# EAGLE schematic LED_PI_0.1 (EAGLE 5.06)
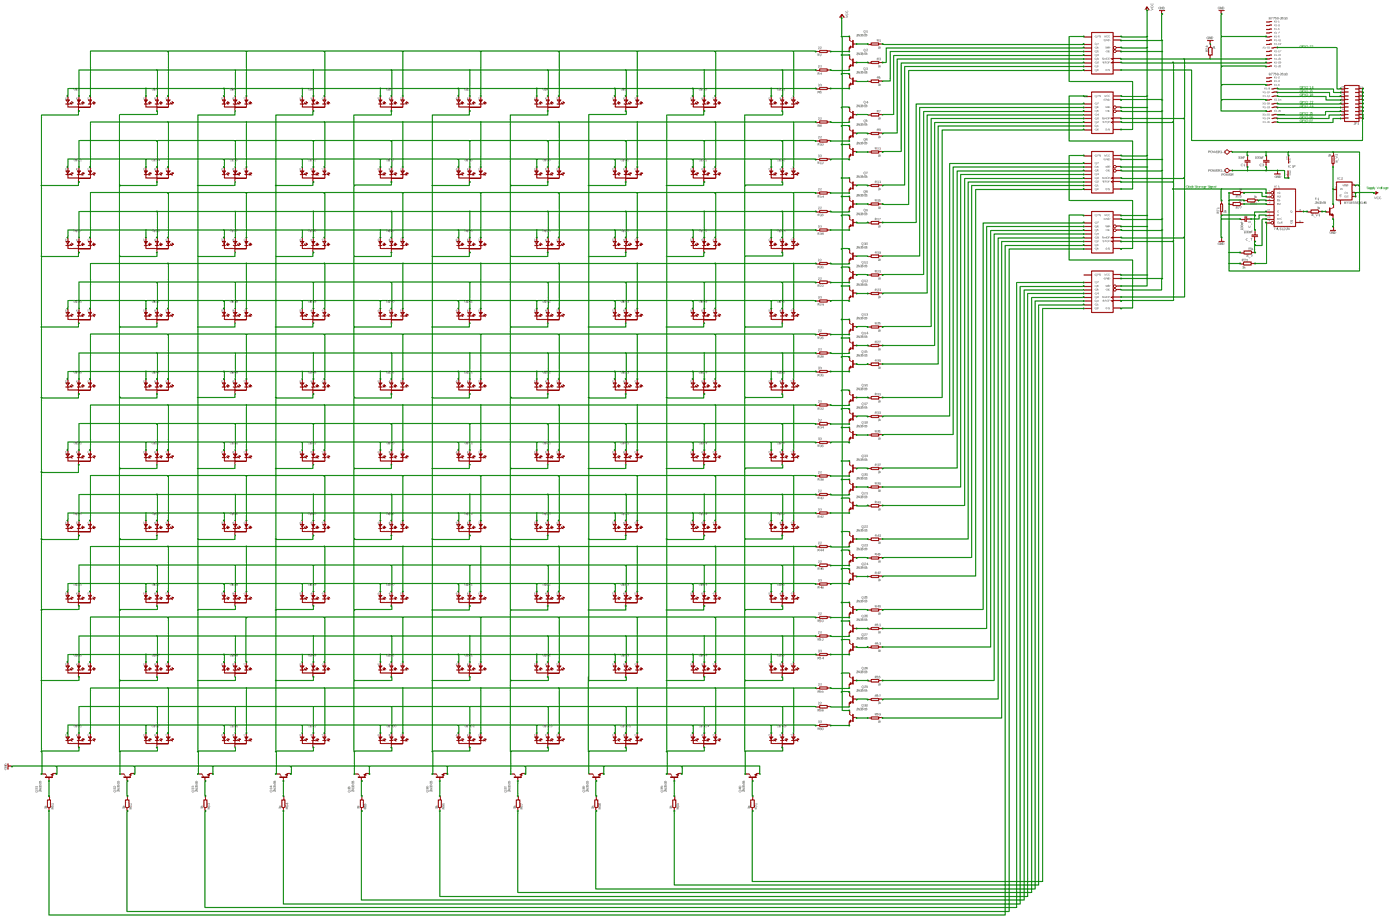
[diagram p0: schematic, sheet 1, overview]
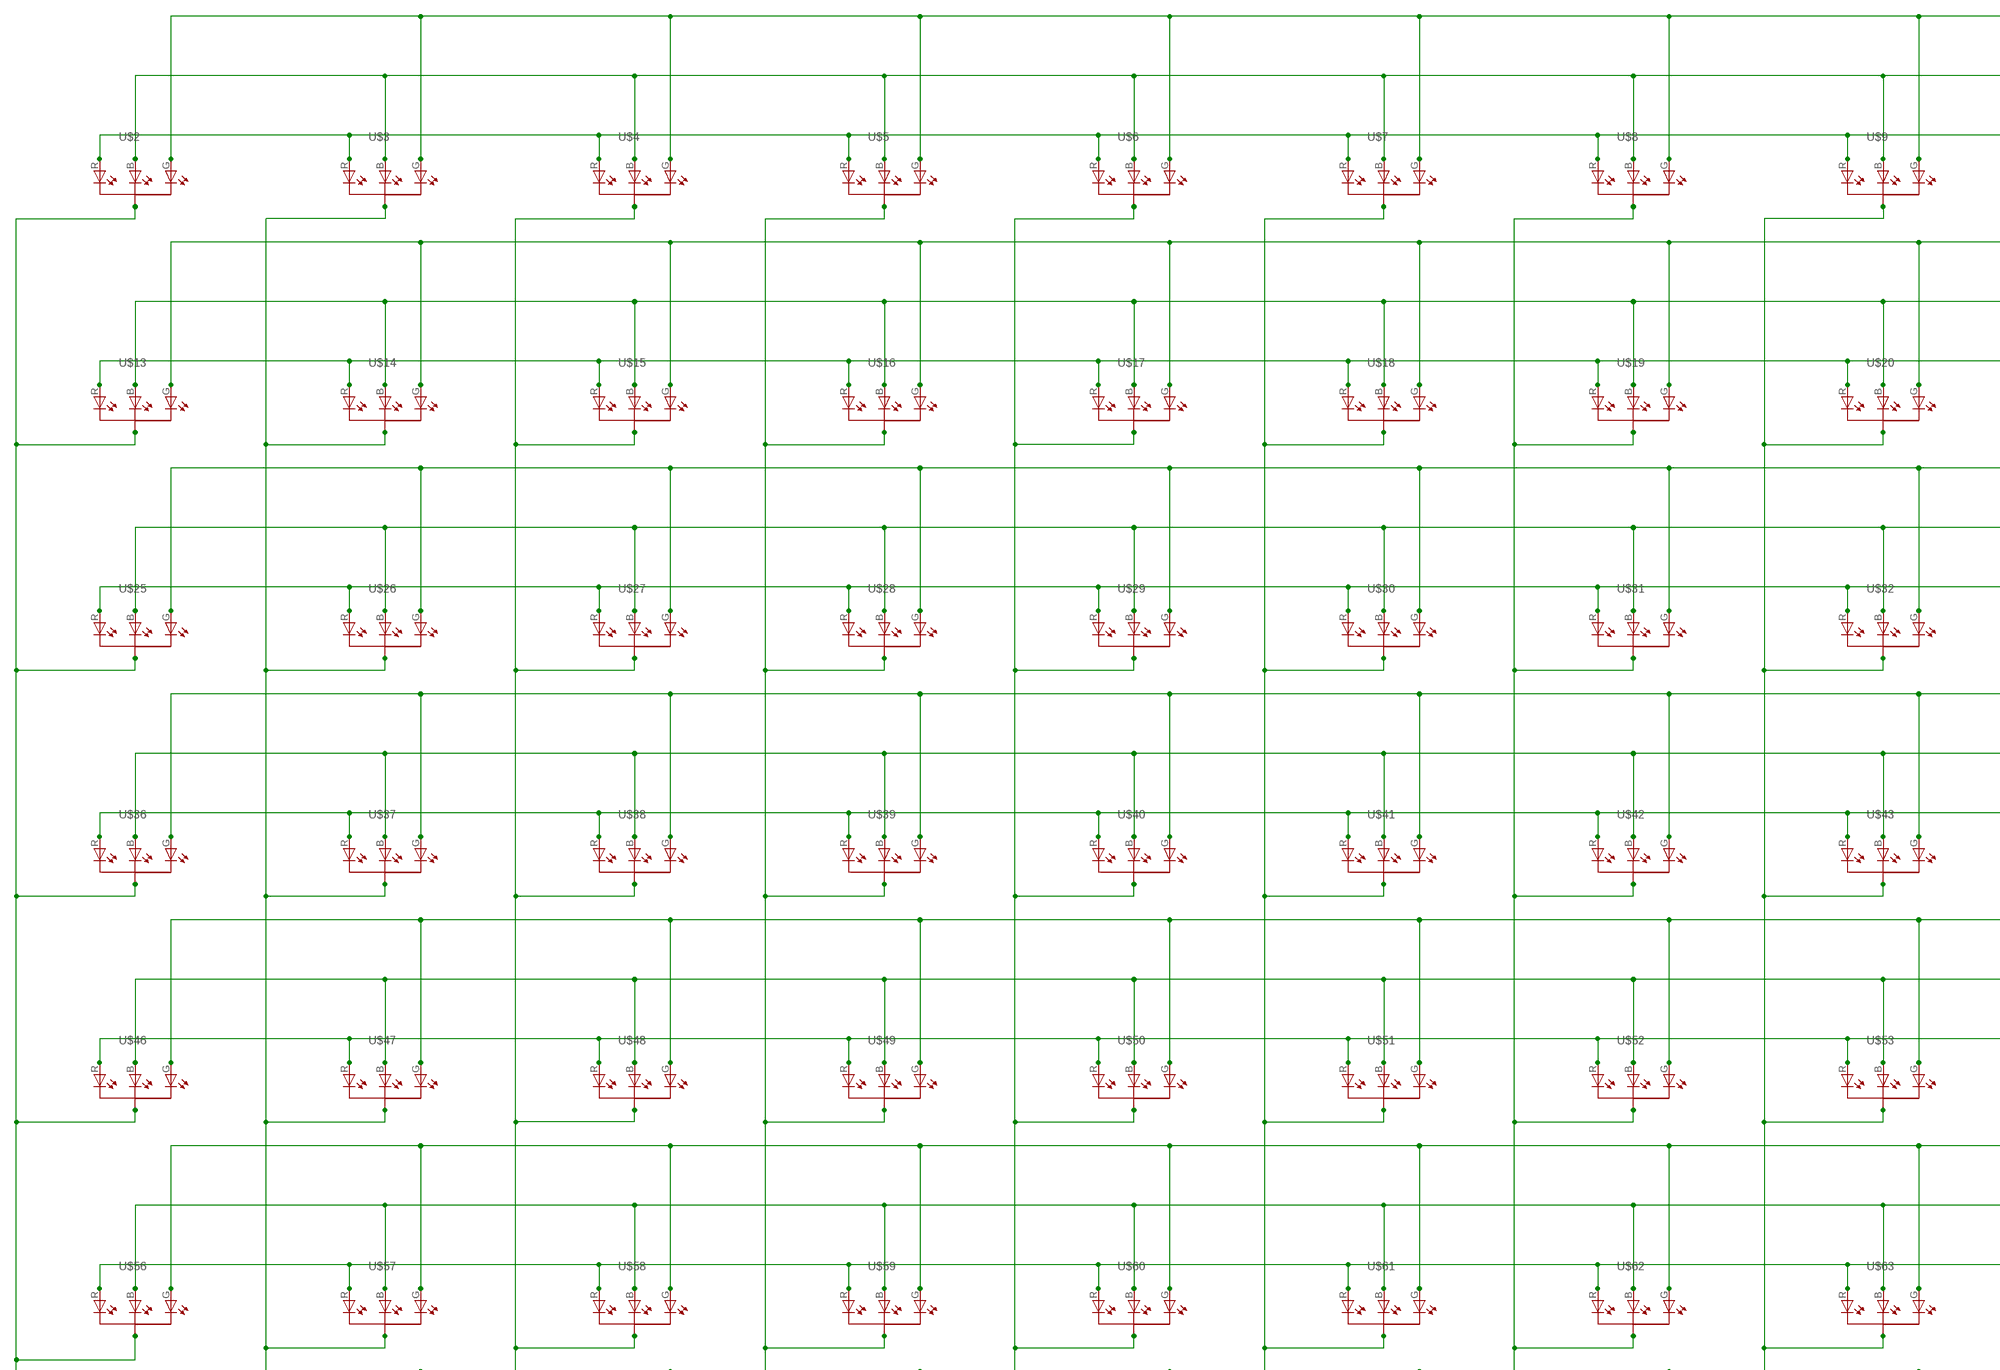
[diagram p1: schematic, sheet 1, part 1 of 5]
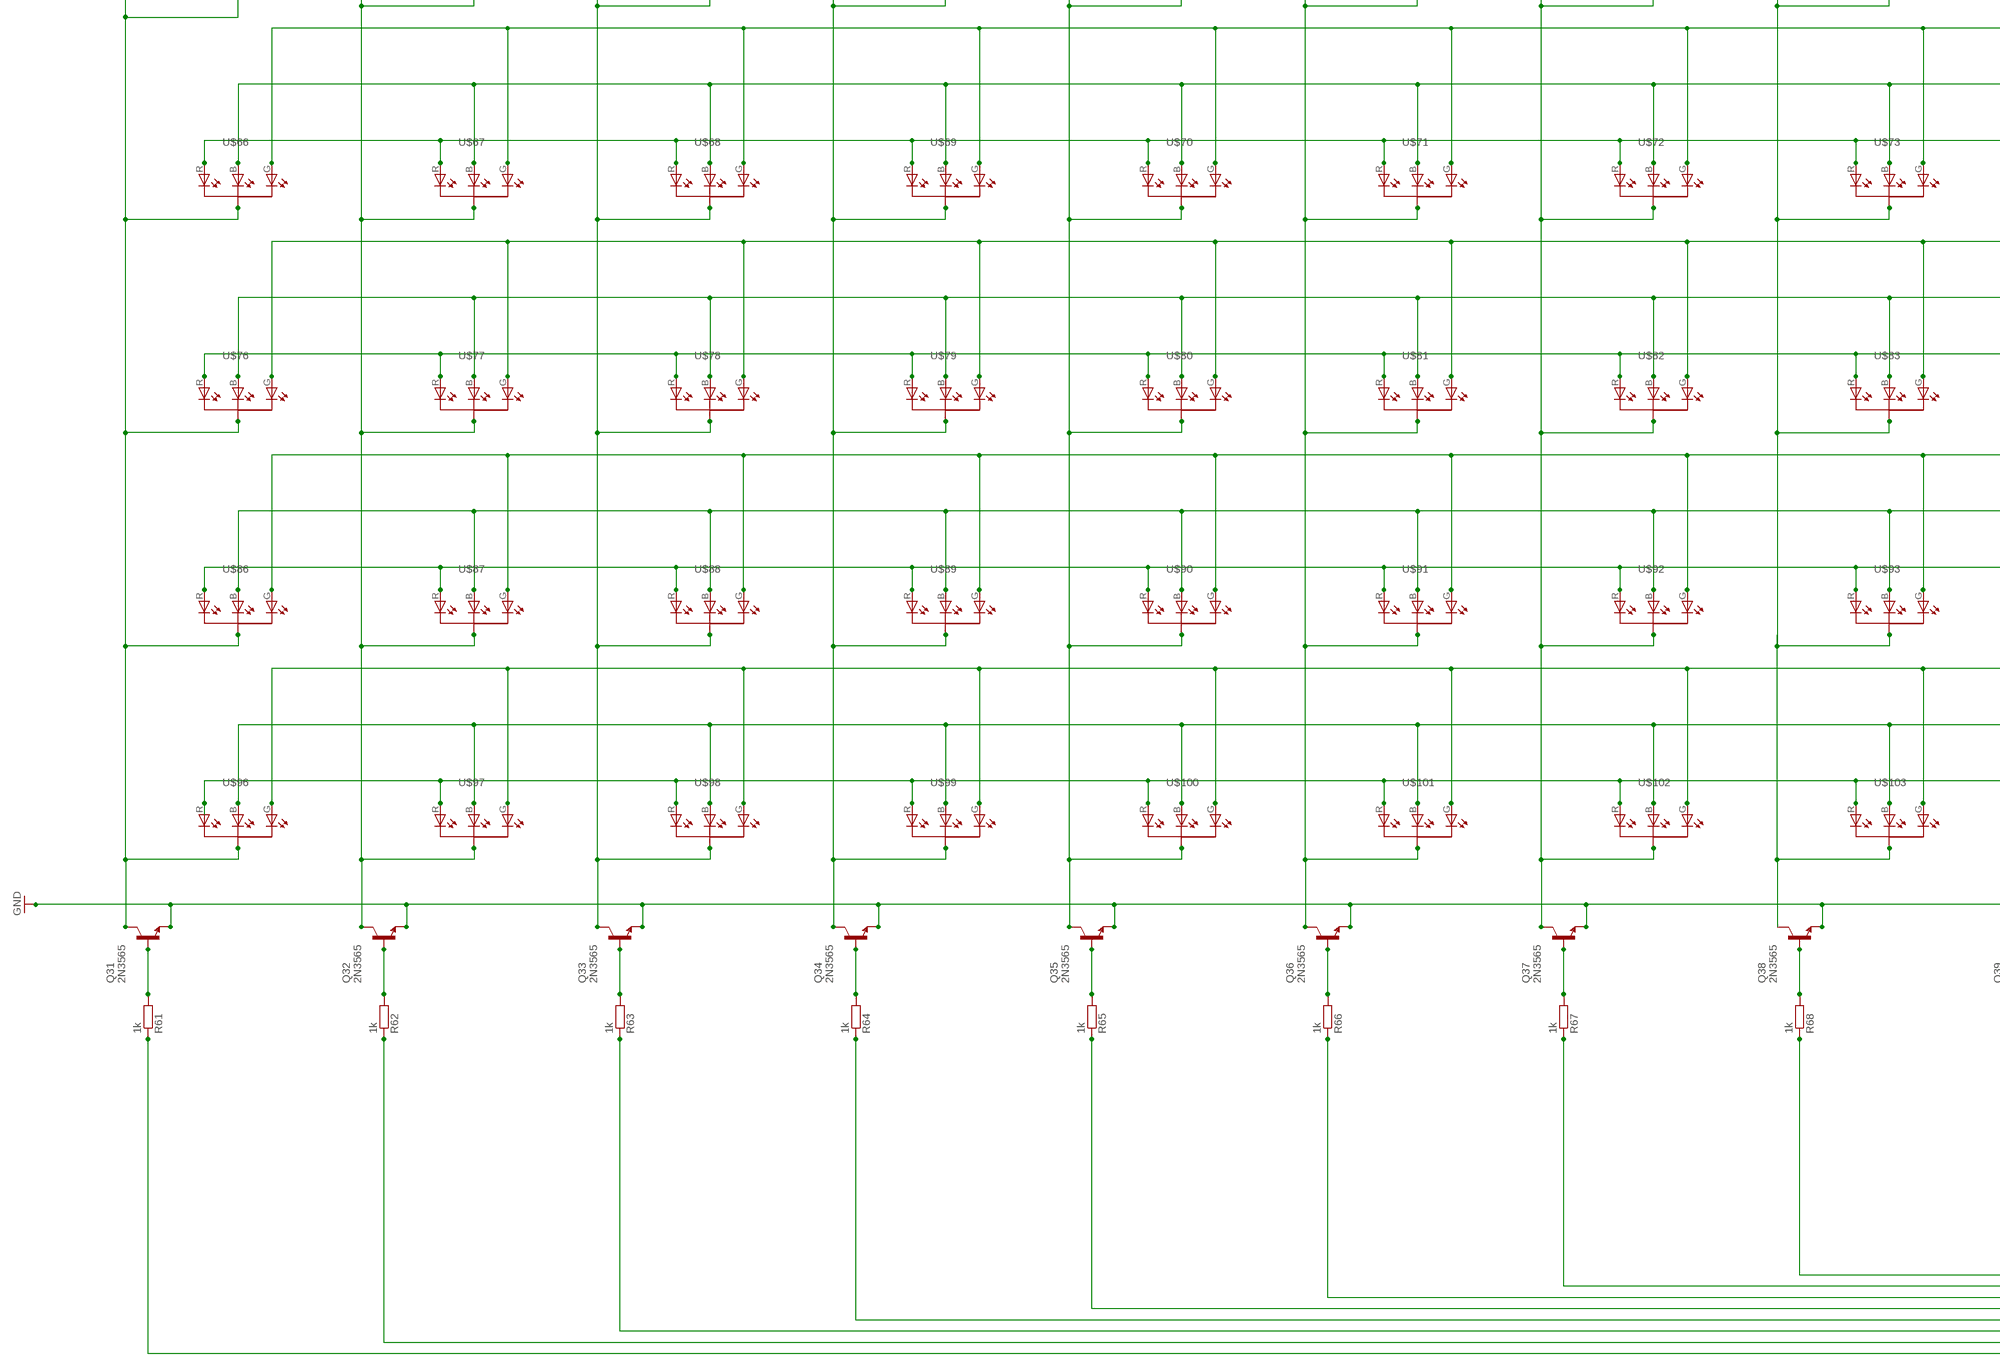
[diagram p2: schematic, sheet 1, part 2 of 5]
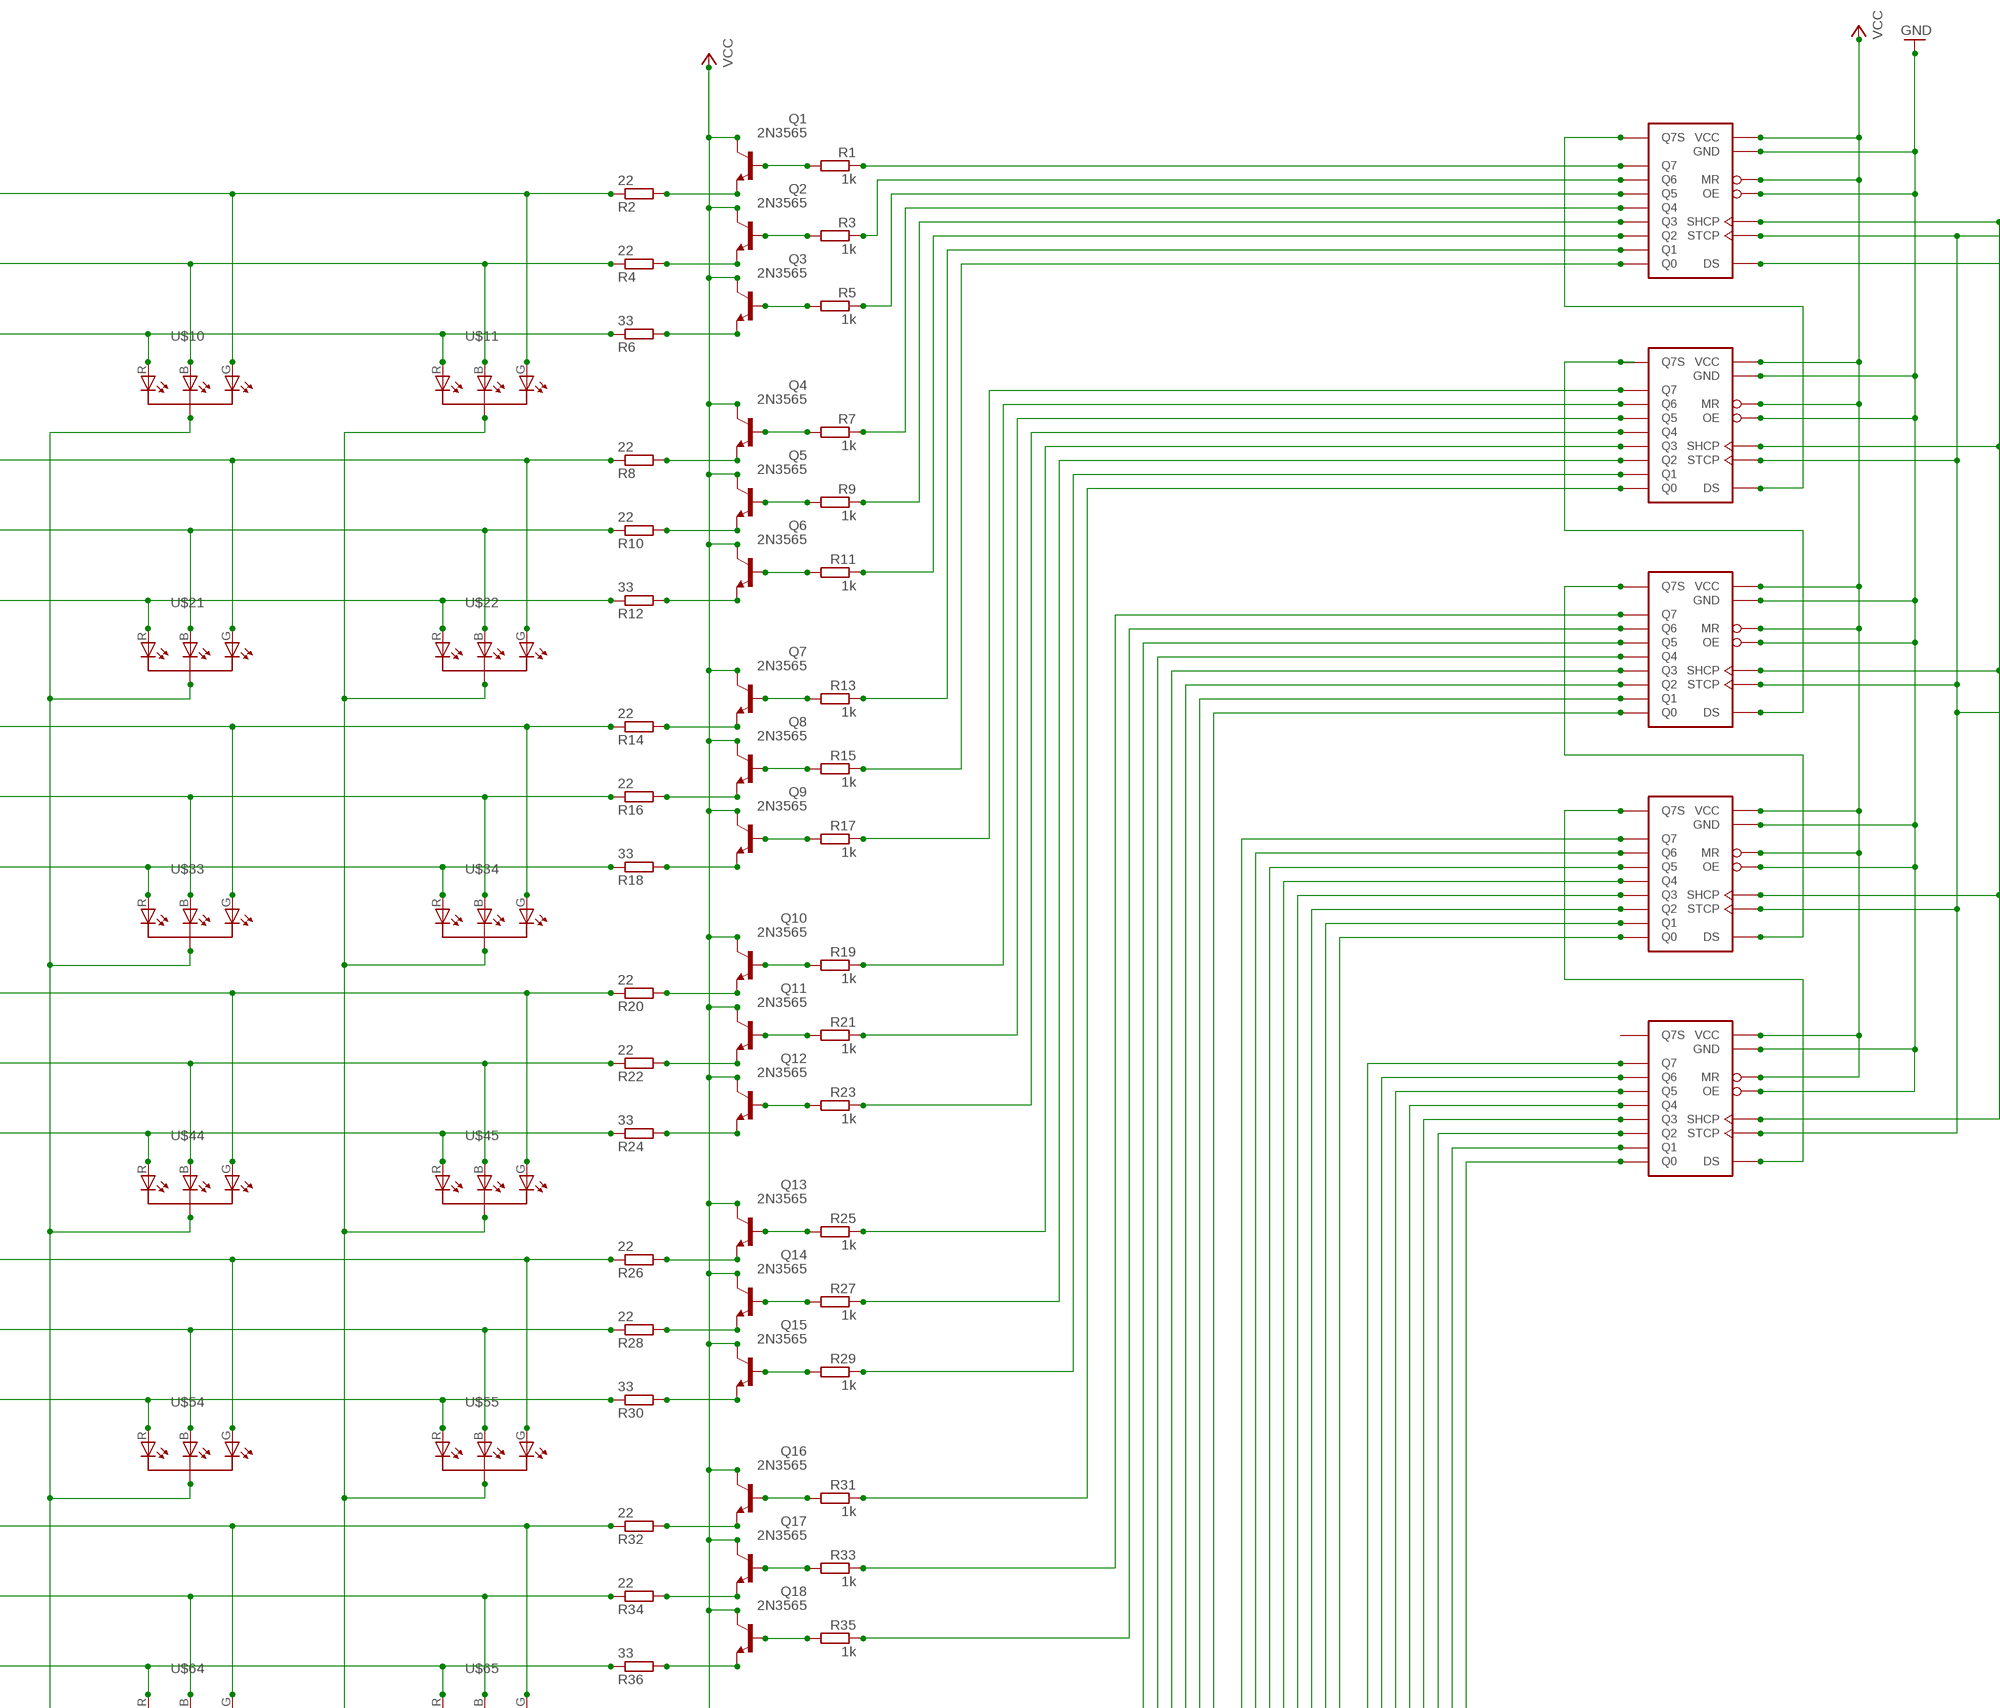
[diagram p3: schematic, sheet 1, part 3 of 5]
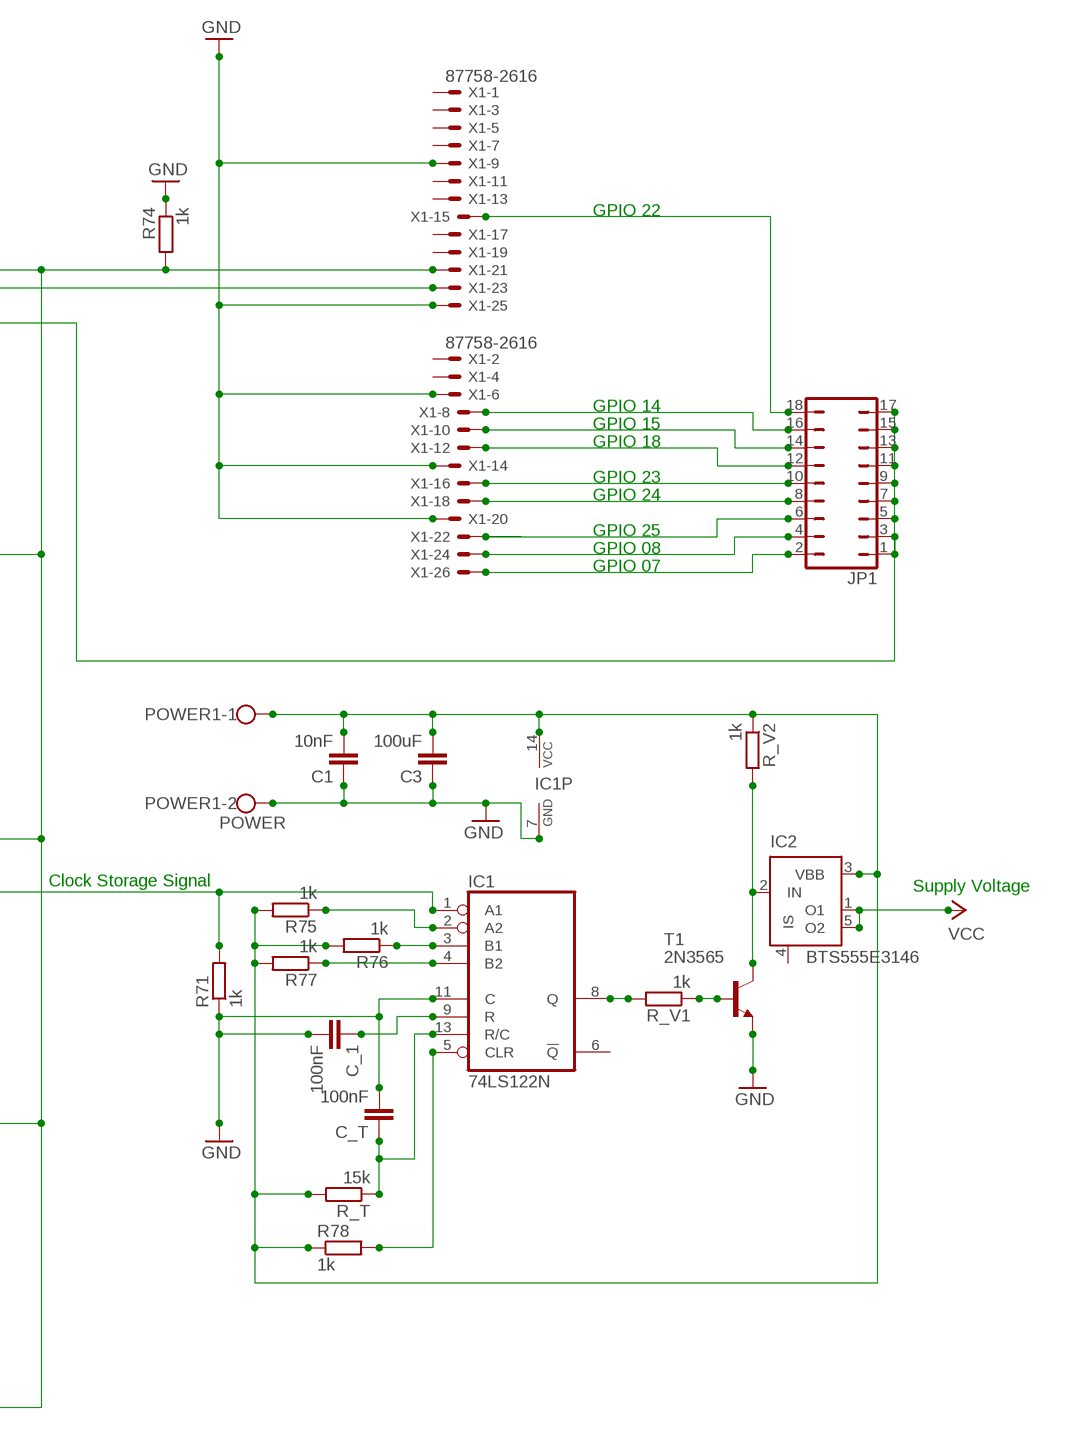
[diagram p4: schematic, sheet 1, part 4 of 5]
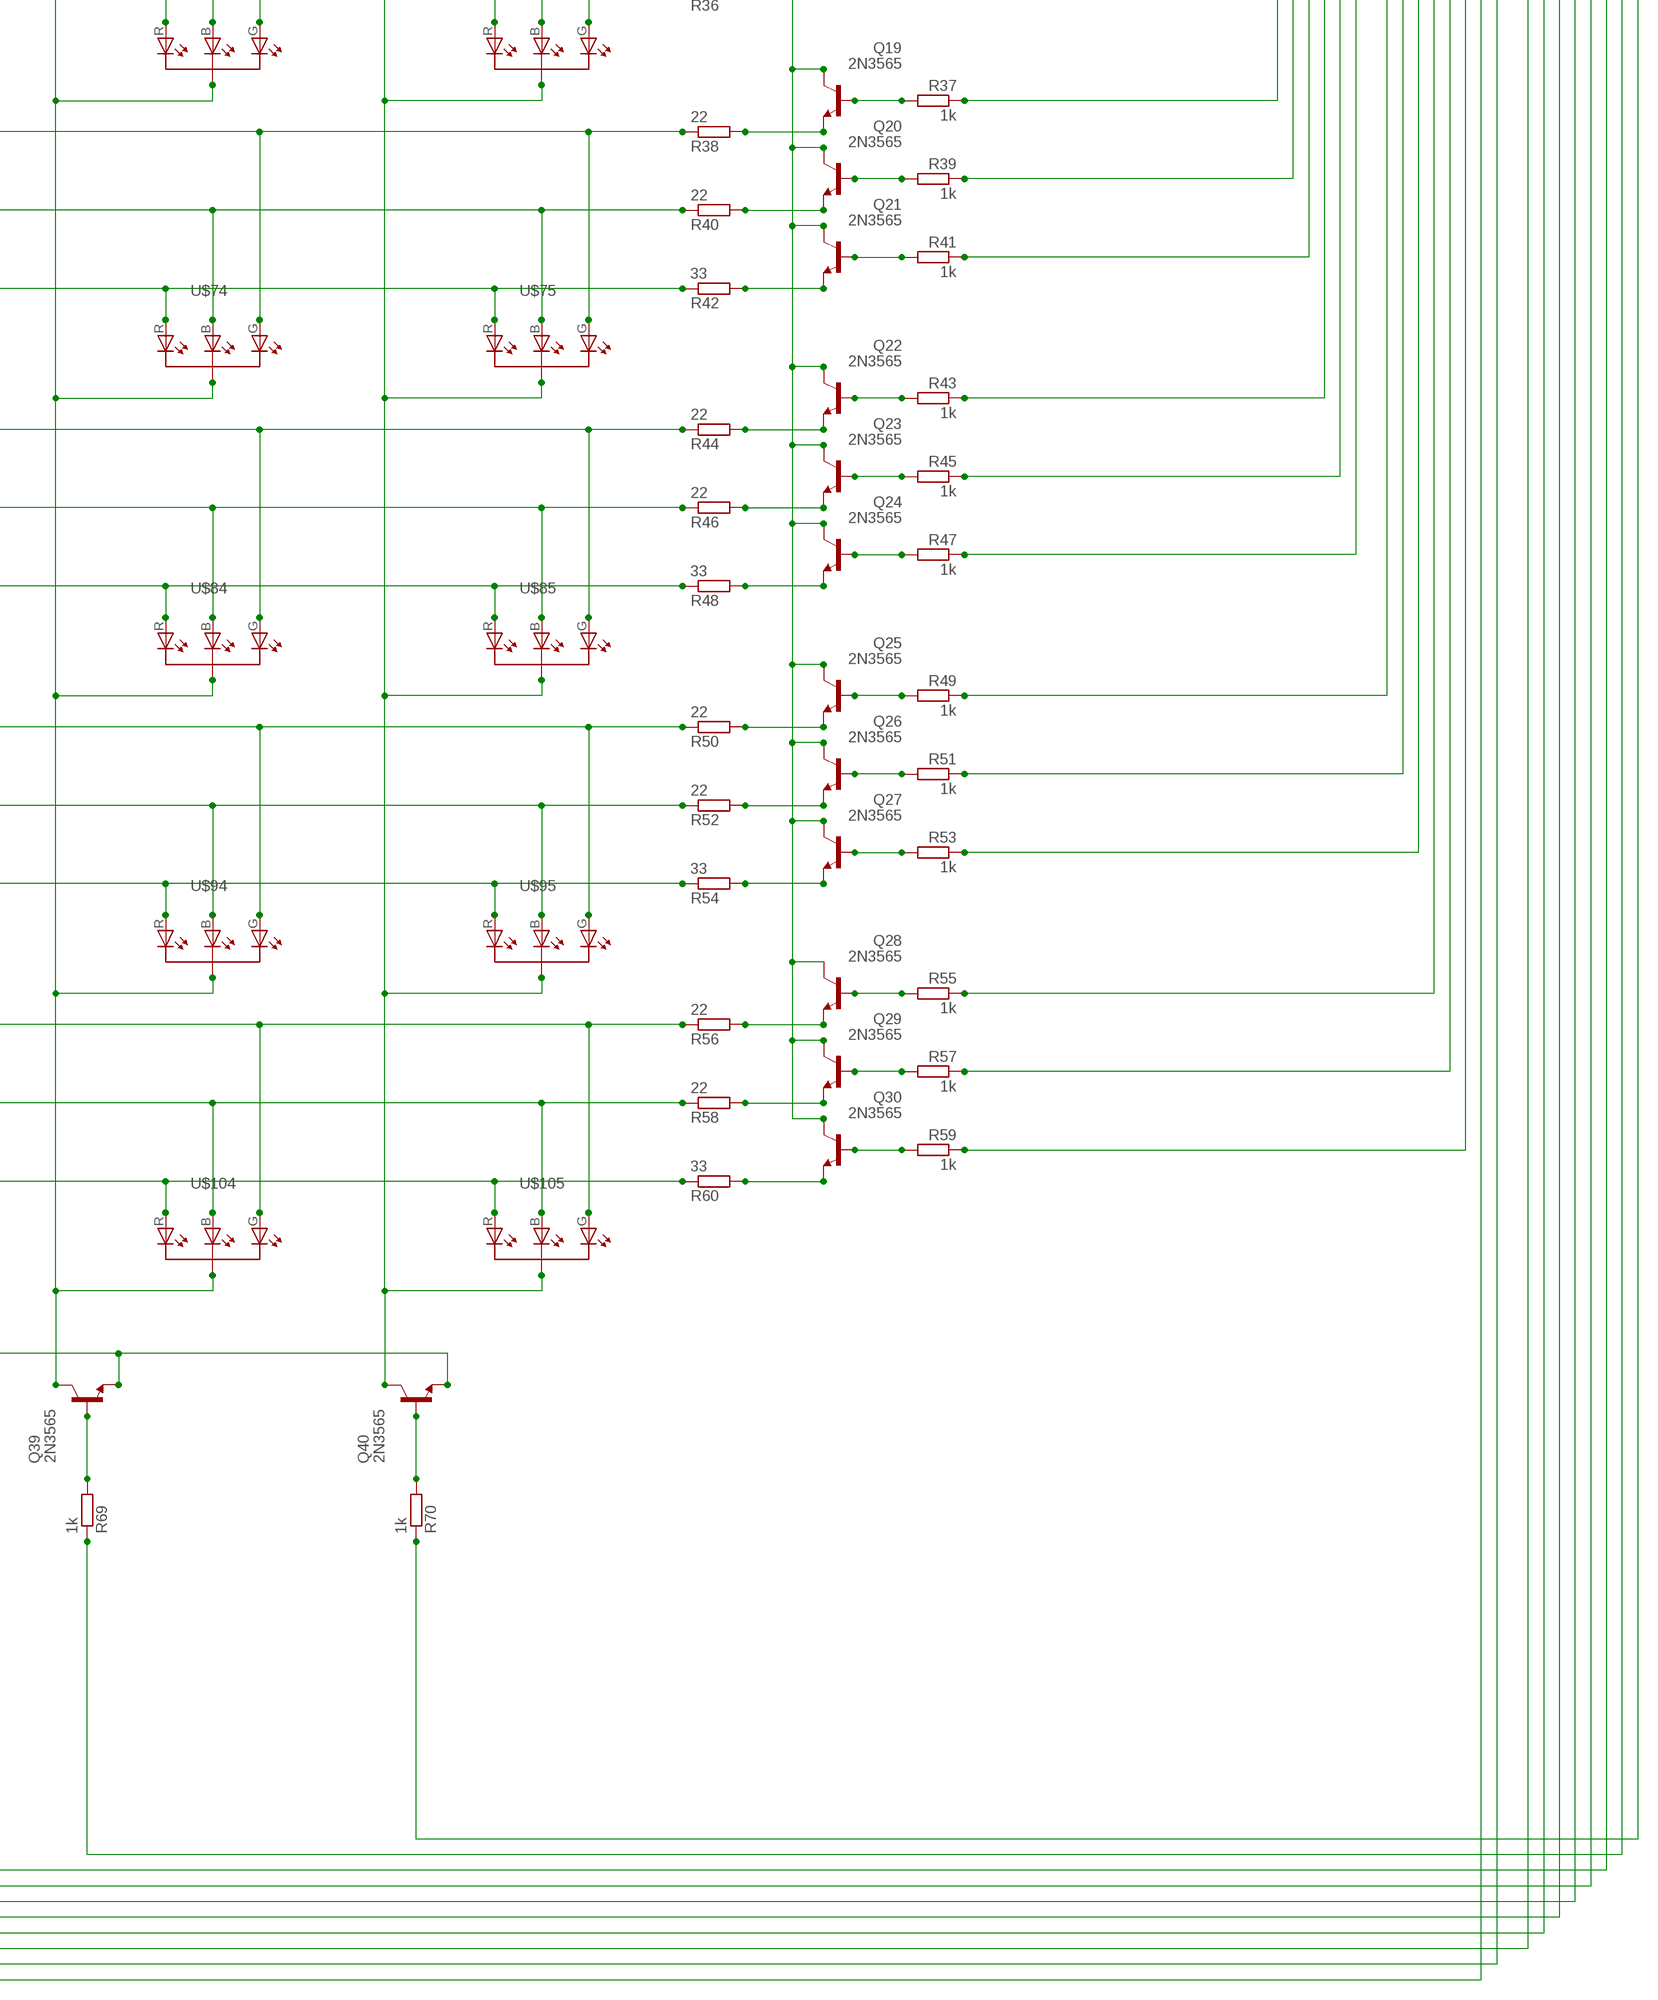
[diagram p5: schematic, sheet 1, part 5 of 5]

## Parts
C1  10nF  C5/2.5  [C5B2.5]
C3  100uF  C5/2.5  [C5B2.5]
C_1  100nF  C5/2.5  [C5B2.5]
C_T  100nF  C5/2.5  [C5B2.5]
IC1  74LS122N  [DIL14]
IC2  BTS555E3146  [TO220-52]
JP1  JP9Q  [JP9Q]
POWER1  POWER  W237-102  [W237-102]
Q1  2N3565  [TO92]
Q2  2N3565  [TO92]
Q3  2N3565  [TO92]
Q4  2N3565  [TO92]
Q5  2N3565  [TO92]
Q6  2N3565  [TO92]
Q7  2N3565  [TO92]
Q8  2N3565  [TO92]
Q9  2N3565  [TO92]
Q10  2N3565  [TO92]
Q11  2N3565  [TO92]
Q12  2N3565  [TO92]
Q13  2N3565  [TO92]
Q14  2N3565  [TO92]
Q15  2N3565  [TO92]
Q16  2N3565  [TO92]
Q17  2N3565  [TO92]
Q18  2N3565  [TO92]
Q19  2N3565  [TO92]
Q20  2N3565  [TO92]
Q21  2N3565  [TO92]
Q22  2N3565  [TO92]
Q23  2N3565  [TO92]
Q24  2N3565  [TO92]
Q25  2N3565  [TO92]
Q26  2N3565  [TO92]
Q27  2N3565  [TO92]
Q28  2N3565  [TO92]
Q29  2N3565  [TO92]
Q30  2N3565  [TO92]
Q31  2N3565  [TO92]
Q32  2N3565  [TO92]
Q33  2N3565  [TO92]
Q34  2N3565  [TO92]
Q35  2N3565  [TO92]
Q36  2N3565  [TO92]
Q37  2N3565  [TO92]
Q38  2N3565  [TO92]
Q39  2N3565  [TO92]
Q40  2N3565  [TO92]
R1  1k  R-EU_0207/10  [0207/10]
R2  22  R-EU_0207/10  [0207/10]
R3  1k  R-EU_0207/10  [0207/10]
R4  22  R-EU_0207/10  [0207/10]
R5  1k  R-EU_0207/10  [0207/10]
R6  33  R-EU_0207/10  [0207/10]
R7  1k  R-EU_0207/10  [0207/10]
R8  22  R-EU_0207/10  [0207/10]
R9  1k  R-EU_0207/10  [0207/10]
R10  22  R-EU_0207/10  [0207/10]
R11  1k  R-EU_0207/10  [0207/10]
R12  33  R-EU_0207/10  [0207/10]
R13  1k  R-EU_0207/10  [0207/10]
R14  22  R-EU_0207/10  [0207/10]
R15  1k  R-EU_0207/10  [0207/10]
R16  22  R-EU_0207/10  [0207/10]
R17  1k  R-EU_0207/10  [0207/10]
R18  33  R-EU_0207/10  [0207/10]
R19  1k  R-EU_0207/10  [0207/10]
R20  22  R-EU_0207/10  [0207/10]
R21  1k  R-EU_0207/10  [0207/10]
R22  22  R-EU_0207/10  [0207/10]
R23  1k  R-EU_0207/10  [0207/10]
R24  33  R-EU_0207/10  [0207/10]
R25  1k  R-EU_0207/10  [0207/10]
R26  22  R-EU_0207/10  [0207/10]
R27  1k  R-EU_0207/10  [0207/10]
R28  22  R-EU_0207/10  [0207/10]
R29  1k  R-EU_0207/10  [0207/10]
R30  33  R-EU_0207/10  [0207/10]
R31  1k  R-EU_0207/10  [0207/10]
R32  22  R-EU_0207/10  [0207/10]
R33  1k  R-EU_0207/10  [0207/10]
R34  22  R-EU_0207/10  [0207/10]
R35  1k  R-EU_0207/10  [0207/10]
R36  33  R-EU_0207/10  [0207/10]
R37  1k  R-EU_0207/10  [0207/10]
R38  22  R-EU_0207/10  [0207/10]
R39  1k  R-EU_0207/10  [0207/10]
R40  22  R-EU_0207/10  [0207/10]
R41  1k  R-EU_0207/10  [0207/10]
R42  33  R-EU_0207/10  [0207/10]
R43  1k  R-EU_0207/10  [0207/10]
R44  22  R-EU_0207/10  [0207/10]
R45  1k  R-EU_0207/10  [0207/10]
R46  22  R-EU_0207/10  [0207/10]
R47  1k  R-EU_0207/10  [0207/10]
R48  33  R-EU_0207/10  [0207/10]
R49  1k  R-EU_0207/10  [0207/10]
R50  22  R-EU_0207/10  [0207/10]
R51  1k  R-EU_0207/10  [0207/10]
R52  22  R-EU_0207/10  [0207/10]
R53  1k  R-EU_0207/10  [0207/10]
R54  33  R-EU_0207/10  [0207/10]
R55  1k  R-EU_0207/10  [0207/10]
R56  22  R-EU_0207/10  [0207/10]
R57  1k  R-EU_0207/10  [0207/10]
R58  22  R-EU_0207/10  [0207/10]
R59  1k  R-EU_0207/10  [0207/10]
R60  33  R-EU_0207/10  [0207/10]
R61  1k  R-EU_0207/10  [0207/10]
R62  1k  R-EU_0207/10  [0207/10]
R63  1k  R-EU_0207/10  [0207/10]
R64  1k  R-EU_0207/10  [0207/10]
R65  1k  R-EU_0207/10  [0207/10]
R66  1k  R-EU_0207/10  [0207/10]
R67  1k  R-EU_0207/10  [0207/10]
R68  1k  R-EU_0207/10  [0207/10]
R69  1k  R-EU_0207/10  [0207/10]
R70  1k  R-EU_0207/10  [0207/10]
R71  1k  R-EU_0207/10  [0207/10]
R74  1k  R-EU_0207/10  [0207/10]
R75  1k  R-EU_0207/10  [0207/10]
R76  1k  R-EU_0207/10  [0207/10]
R77  1k  R-EU_0207/10  [0207/10]
R78  1k  R-EU_0207/10  [0207/10]
R_T  15k  R-EU_0207/10  [0207/10]
R_V1  1k  R-EU_0207/10  [0207/10]
R_V2  1k  R-EU_0207/10  [0207/10]
T1  2N3565  [TO92]
U$1  74_595_SHIFT_REGISTER  [DIL16]
U$2  RGB_KINGBRIGHT_5MM  [T-1_3/4_5MM]
U$3  RGB_KINGBRIGHT_5MM  [T-1_3/4_5MM]
U$4  RGB_KINGBRIGHT_5MM  [T-1_3/4_5MM]
U$5  RGB_KINGBRIGHT_5MM  [T-1_3/4_5MM]
U$6  RGB_KINGBRIGHT_5MM  [T-1_3/4_5MM]
U$7  RGB_KINGBRIGHT_5MM  [T-1_3/4_5MM]
U$8  RGB_KINGBRIGHT_5MM  [T-1_3/4_5MM]
U$9  RGB_KINGBRIGHT_5MM  [T-1_3/4_5MM]
U$10  RGB_KINGBRIGHT_5MM  [T-1_3/4_5MM]
U$11  RGB_KINGBRIGHT_5MM  [T-1_3/4_5MM]
U$12  74_595_SHIFT_REGISTER  [DIL16]
U$13  RGB_KINGBRIGHT_5MM  [T-1_3/4_5MM]
U$14  RGB_KINGBRIGHT_5MM  [T-1_3/4_5MM]
U$15  RGB_KINGBRIGHT_5MM  [T-1_3/4_5MM]
U$16  RGB_KINGBRIGHT_5MM  [T-1_3/4_5MM]
U$17  RGB_KINGBRIGHT_5MM  [T-1_3/4_5MM]
U$18  RGB_KINGBRIGHT_5MM  [T-1_3/4_5MM]
U$19  RGB_KINGBRIGHT_5MM  [T-1_3/4_5MM]
U$20  RGB_KINGBRIGHT_5MM  [T-1_3/4_5MM]
U$21  RGB_KINGBRIGHT_5MM  [T-1_3/4_5MM]
U$22  RGB_KINGBRIGHT_5MM  [T-1_3/4_5MM]
U$23  74_595_SHIFT_REGISTER  [DIL16]
U$24  74_595_SHIFT_REGISTER  [DIL16]
U$25  RGB_KINGBRIGHT_5MM  [T-1_3/4_5MM]
U$26  RGB_KINGBRIGHT_5MM  [T-1_3/4_5MM]
U$27  RGB_KINGBRIGHT_5MM  [T-1_3/4_5MM]
U$28  RGB_KINGBRIGHT_5MM  [T-1_3/4_5MM]
U$29  RGB_KINGBRIGHT_5MM  [T-1_3/4_5MM]
U$30  RGB_KINGBRIGHT_5MM  [T-1_3/4_5MM]
U$31  RGB_KINGBRIGHT_5MM  [T-1_3/4_5MM]
U$32  RGB_KINGBRIGHT_5MM  [T-1_3/4_5MM]
U$33  RGB_KINGBRIGHT_5MM  [T-1_3/4_5MM]
U$34  RGB_KINGBRIGHT_5MM  [T-1_3/4_5MM]
U$35  74_595_SHIFT_REGISTER  [DIL16]
U$36  RGB_KINGBRIGHT_5MM  [T-1_3/4_5MM]
U$37  RGB_KINGBRIGHT_5MM  [T-1_3/4_5MM]
U$38  RGB_KINGBRIGHT_5MM  [T-1_3/4_5MM]
U$39  RGB_KINGBRIGHT_5MM  [T-1_3/4_5MM]
U$40  RGB_KINGBRIGHT_5MM  [T-1_3/4_5MM]
U$41  RGB_KINGBRIGHT_5MM  [T-1_3/4_5MM]
U$42  RGB_KINGBRIGHT_5MM  [T-1_3/4_5MM]
U$43  RGB_KINGBRIGHT_5MM  [T-1_3/4_5MM]
U$44  RGB_KINGBRIGHT_5MM  [T-1_3/4_5MM]
U$45  RGB_KINGBRIGHT_5MM  [T-1_3/4_5MM]
U$46  RGB_KINGBRIGHT_5MM  [T-1_3/4_5MM]
U$47  RGB_KINGBRIGHT_5MM  [T-1_3/4_5MM]
U$48  RGB_KINGBRIGHT_5MM  [T-1_3/4_5MM]
U$49  RGB_KINGBRIGHT_5MM  [T-1_3/4_5MM]
U$50  RGB_KINGBRIGHT_5MM  [T-1_3/4_5MM]
U$51  RGB_KINGBRIGHT_5MM  [T-1_3/4_5MM]
U$52  RGB_KINGBRIGHT_5MM  [T-1_3/4_5MM]
U$53  RGB_KINGBRIGHT_5MM  [T-1_3/4_5MM]
U$54  RGB_KINGBRIGHT_5MM  [T-1_3/4_5MM]
U$55  RGB_KINGBRIGHT_5MM  [T-1_3/4_5MM]
U$56  RGB_KINGBRIGHT_5MM  [T-1_3/4_5MM]
U$57  RGB_KINGBRIGHT_5MM  [T-1_3/4_5MM]
U$58  RGB_KINGBRIGHT_5MM  [T-1_3/4_5MM]
U$59  RGB_KINGBRIGHT_5MM  [T-1_3/4_5MM]
U$60  RGB_KINGBRIGHT_5MM  [T-1_3/4_5MM]
U$61  RGB_KINGBRIGHT_5MM  [T-1_3/4_5MM]
U$62  RGB_KINGBRIGHT_5MM  [T-1_3/4_5MM]
U$63  RGB_KINGBRIGHT_5MM  [T-1_3/4_5MM]
U$64  RGB_KINGBRIGHT_5MM  [T-1_3/4_5MM]
U$65  RGB_KINGBRIGHT_5MM  [T-1_3/4_5MM]
U$66  RGB_KINGBRIGHT_5MM  [T-1_3/4_5MM]
U$67  RGB_KINGBRIGHT_5MM  [T-1_3/4_5MM]
U$68  RGB_KINGBRIGHT_5MM  [T-1_3/4_5MM]
U$69  RGB_KINGBRIGHT_5MM  [T-1_3/4_5MM]
U$70  RGB_KINGBRIGHT_5MM  [T-1_3/4_5MM]
U$71  RGB_KINGBRIGHT_5MM  [T-1_3/4_5MM]
U$72  RGB_KINGBRIGHT_5MM  [T-1_3/4_5MM]
U$73  RGB_KINGBRIGHT_5MM  [T-1_3/4_5MM]
U$74  RGB_KINGBRIGHT_5MM  [T-1_3/4_5MM]
U$75  RGB_KINGBRIGHT_5MM  [T-1_3/4_5MM]
U$76  RGB_KINGBRIGHT_5MM  [T-1_3/4_5MM]
U$77  RGB_KINGBRIGHT_5MM  [T-1_3/4_5MM]
U$78  RGB_KINGBRIGHT_5MM  [T-1_3/4_5MM]
U$79  RGB_KINGBRIGHT_5MM  [T-1_3/4_5MM]
U$80  RGB_KINGBRIGHT_5MM  [T-1_3/4_5MM]
U$81  RGB_KINGBRIGHT_5MM  [T-1_3/4_5MM]
U$82  RGB_KINGBRIGHT_5MM  [T-1_3/4_5MM]
U$83  RGB_KINGBRIGHT_5MM  [T-1_3/4_5MM]
U$84  RGB_KINGBRIGHT_5MM  [T-1_3/4_5MM]
U$85  RGB_KINGBRIGHT_5MM  [T-1_3/4_5MM]
U$86  RGB_KINGBRIGHT_5MM  [T-1_3/4_5MM]
U$87  RGB_KINGBRIGHT_5MM  [T-1_3/4_5MM]
U$88  RGB_KINGBRIGHT_5MM  [T-1_3/4_5MM]
U$89  RGB_KINGBRIGHT_5MM  [T-1_3/4_5MM]
U$90  RGB_KINGBRIGHT_5MM  [T-1_3/4_5MM]
U$91  RGB_KINGBRIGHT_5MM  [T-1_3/4_5MM]
U$92  RGB_KINGBRIGHT_5MM  [T-1_3/4_5MM]
U$93  RGB_KINGBRIGHT_5MM  [T-1_3/4_5MM]
U$94  RGB_KINGBRIGHT_5MM  [T-1_3/4_5MM]
U$95  RGB_KINGBRIGHT_5MM  [T-1_3/4_5MM]
U$96  RGB_KINGBRIGHT_5MM  [T-1_3/4_5MM]
U$97  RGB_KINGBRIGHT_5MM  [T-1_3/4_5MM]
U$98  RGB_KINGBRIGHT_5MM  [T-1_3/4_5MM]
U$99  RGB_KINGBRIGHT_5MM  [T-1_3/4_5MM]
U$100  RGB_KINGBRIGHT_5MM  [T-1_3/4_5MM]
U$101  RGB_KINGBRIGHT_5MM  [T-1_3/4_5MM]
U$102  RGB_KINGBRIGHT_5MM  [T-1_3/4_5MM]
U$103  RGB_KINGBRIGHT_5MM  [T-1_3/4_5MM]
U$104  RGB_KINGBRIGHT_5MM  [T-1_3/4_5MM]
U$105  RGB_KINGBRIGHT_5MM  [T-1_3/4_5MM]
X1  87758-2616  [87758-2616]

## Nets
GND: C1.1 C3.1 C_1.2 C_T.2 IC1.7(GND) IC1.11(C) POWER1.2 Q31.3(E) Q32.3(E) Q33.3(E) Q34.3(E) Q35.3(E) Q36.3(E) Q37.3(E) Q38.3(E) Q39.3(E) Q40.3(E) R71.1 R74.1 T1.3(E) U$1.8(GND) U$1.13(OE) U$12.8(GND) U$12.13(OE) U$23.8(GND) U$23.13(OE) U$24.8(GND) U$24.13(OE) U$35.8(GND) U$35.13(OE) X1.6 X1.9 X1.14 X1.20 X1.25
N$1: Q25.2(B) R49.2
N$2: Q26.2(B) R51.2
N$3: Q27.2(B) R53.2
N$4: Q29.3(E) R58.2
N$5: Q27.3(E) R54.2
N$6: Q26.3(E) R52.2
N$7: Q25.3(E) R50.2
N$8: Q22.2(B) R43.2
N$9: Q23.2(B) R45.2
N$10: Q24.2(B) R47.2
N$11: Q24.3(E) R48.2
N$12: Q23.3(E) R46.2
N$13: Q22.3(E) R44.2
N$14: Q19.2(B) R37.2
N$15: Q20.2(B) R39.2
N$16: Q21.2(B) R41.2
N$17: Q21.3(E) R42.2
N$18: Q20.3(E) R40.2
N$19: Q19.3(E) R38.2
N$20: Q16.2(B) R31.2
N$21: Q17.2(B) R33.2
N$22: Q18.2(B) R35.2
N$23: Q18.3(E) R36.2
N$24: Q17.3(E) R34.2
N$25: Q16.3(E) R32.2
N$26: Q13.2(B) R25.2
N$27: Q14.2(B) R27.2
N$28: Q15.2(B) R29.2
N$29: Q15.3(E) R30.2
N$30: Q14.3(E) R28.2
N$31: Q13.3(E) R26.2
N$32: Q10.2(B) R19.2
N$33: Q11.2(B) R21.2
N$34: Q12.2(B) R23.2
N$35: Q12.3(E) R24.2
N$36: Q11.3(E) R22.2
N$37: Q10.3(E) R20.2
N$38: Q7.2(B) R13.2
N$39: Q8.2(B) R15.2
N$40: Q9.2(B) R17.2
N$41: Q9.3(E) R18.2
N$42: Q30.3(E) R60.2
N$43: Q28.3(E) R56.2
N$44: Q28.2(B) R55.2
N$45: Q39.2(B) R69.2
N$46: Q29.2(B) R57.2
N$47: Q30.2(B) R59.2
N$48: Q8.3(E) R16.2
N$49: Q7.3(E) R14.2
N$50: Q4.2(B) R7.2
N$51: Q5.2(B) R9.2
N$52: Q6.2(B) R11.2
N$53: Q6.3(E) R12.2
N$54: Q5.3(E) R10.2
N$55: Q4.3(E) R8.2
N$56: Q1.2(B) R1.2
N$57: Q2.2(B) R3.2
N$58: Q3.2(B) R5.2
N$59: Q3.3(E) R6.2
N$60: Q2.3(E) R4.2
N$61: Q1.3(E) R2.2
N$62: Q40.2(B) R70.2
N$63: Q39.1(C) U$10.COM U$21.COM U$33.COM U$44.COM U$54.COM U$64.COM U$74.COM U$84.COM U$94.COM U$104.COM
N$64: Q38.1(C) U$9.COM U$20.COM U$32.COM U$43.COM U$53.COM U$63.COM U$73.COM U$83.COM U$93.COM U$103.COM
N$65: R56.1 U$96.G U$97.G U$98.G U$99.G U$100.G U$101.G U$102.G U$103.G U$104.G U$105.G
N$66: R58.1 U$96.B U$97.B U$98.B U$99.B U$100.B U$101.B U$102.B U$103.B U$104.B U$105.B
N$67: R60.1 U$96.R U$97.R U$98.R U$99.R U$100.R U$101.R U$102.R U$103.R U$104.R U$105.R
N$68: R54.1 U$86.R U$87.R U$88.R U$89.R U$90.R U$91.R U$92.R U$93.R U$94.R U$95.R
N$69: R52.1 U$86.B U$87.B U$88.B U$89.B U$90.B U$91.B U$92.B U$93.B U$94.B U$95.B
N$70: R50.1 U$86.G U$87.G U$88.G U$89.G U$90.G U$91.G U$92.G U$93.G U$94.G U$95.G
N$71: Q37.1(C) U$8.COM U$19.COM U$31.COM U$42.COM U$52.COM U$62.COM U$72.COM U$82.COM U$92.COM U$102.COM
N$72: Q36.1(C) U$7.COM U$18.COM U$30.COM U$41.COM U$51.COM U$61.COM U$71.COM U$81.COM U$91.COM U$101.COM
N$73: IC1.2(A2) R75.1
N$74: JP1.10 X1.16
N$75: Q34.1(C) U$5.COM U$16.COM U$28.COM U$39.COM U$49.COM U$59.COM U$69.COM U$79.COM U$89.COM U$99.COM
N$76: Q35.1(C) U$6.COM U$17.COM U$29.COM U$40.COM U$50.COM U$60.COM U$70.COM U$80.COM U$90.COM U$100.COM
N$77: R48.1 U$76.R U$77.R U$78.R U$79.R U$80.R U$81.R U$82.R U$83.R U$84.R U$85.R
N$78: Q38.2(B) R68.2
N$79: Q31.1(C) U$2.COM U$13.COM U$25.COM U$36.COM U$46.COM U$56.COM U$66.COM U$76.COM U$86.COM U$96.COM
N$80: R46.1 U$76.B U$77.B U$78.B U$79.B U$80.B U$81.B U$82.B U$83.B U$84.B U$85.B
N$81: R44.1 U$76.G U$77.G U$78.G U$79.G U$80.G U$81.G U$82.G U$83.G U$84.G U$85.G
N$82: Q40.1(C) U$11.COM U$22.COM U$34.COM U$45.COM U$55.COM U$65.COM U$75.COM U$85.COM U$95.COM U$105.COM
N$83: R42.1 U$66.R U$67.R U$68.R U$69.R U$70.R U$71.R U$72.R U$73.R U$74.R U$75.R
N$84: R40.1 U$66.B U$67.B U$68.B U$69.B U$70.B U$71.B U$72.B U$73.B U$74.B U$75.B
N$85: R38.1 U$66.G U$67.G U$68.G U$69.G U$70.G U$71.G U$72.G U$73.G U$74.G U$75.G
N$86: Q37.2(B) R67.2
N$87: R36.1 U$56.R U$57.R U$58.R U$59.R U$60.R U$61.R U$62.R U$63.R U$64.R U$65.R
N$88: R34.1 U$56.B U$57.B U$58.B U$59.B U$60.B U$61.B U$62.B U$63.B U$64.B U$65.B
N$89: R32.1 U$56.G U$57.G U$58.G U$59.G U$60.G U$61.G U$62.G U$63.G U$64.G U$65.G
N$90: Q32.1(C) U$3.COM U$14.COM U$26.COM U$37.COM U$47.COM U$57.COM U$67.COM U$77.COM U$87.COM U$97.COM
N$91: R30.1 U$46.R U$47.R U$48.R U$49.R U$50.R U$51.R U$52.R U$53.R U$54.R U$55.R
N$92: R28.1 U$46.B U$47.B U$48.B U$49.B U$50.B U$51.B U$52.B U$53.B U$54.B U$55.B
N$93: R26.1 U$46.G U$47.G U$48.G U$49.G U$50.G U$51.G U$52.G U$53.G U$54.G U$55.G
N$94: Q36.2(B) R66.2
N$95: R24.1 U$36.R U$37.R U$38.R U$39.R U$40.R U$41.R U$42.R U$43.R U$44.R U$45.R
N$96: R22.1 U$36.B U$37.B U$38.B U$39.B U$40.B U$41.B U$42.B U$43.B U$44.B U$45.B
N$97: R20.1 U$36.G U$37.G U$38.G U$39.G U$40.G U$41.G U$42.G U$43.G U$44.G U$45.G
N$98: Q35.2(B) R65.2
N$99: R18.1 U$25.R U$26.R U$27.R U$28.R U$29.R U$30.R U$31.R U$32.R U$33.R U$34.R
N$100: R16.1 U$25.B U$26.B U$27.B U$28.B U$29.B U$30.B U$31.B U$32.B U$33.B U$34.B
N$101: R14.1 U$25.G U$26.G U$27.G U$28.G U$29.G U$30.G U$31.G U$32.G U$33.G U$34.G
N$102: Q34.2(B) R64.2
N$103: R12.1 U$13.R U$14.R U$15.R U$16.R U$17.R U$18.R U$19.R U$20.R U$21.R U$22.R
N$104: R10.1 U$13.B U$14.B U$15.B U$16.B U$17.B U$18.B U$19.B U$20.B U$21.B U$22.B
N$105: R8.1 U$13.G U$14.G U$15.G U$16.G U$17.G U$18.G U$19.G U$20.G U$21.G U$22.G
N$106: Q33.2(B) R63.2
N$107: R6.1 U$2.R U$3.R U$4.R U$5.R U$6.R U$7.R U$8.R U$9.R U$10.R U$11.R
N$108: R4.1 U$2.B U$3.B U$4.B U$5.B U$6.B U$7.B U$8.B U$9.B U$10.B U$11.B
N$109: R2.1 U$2.G U$3.G U$4.G U$5.G U$6.G U$7.G U$8.G U$9.G U$10.G U$11.G
N$110: Q32.2(B) R62.2
N$111: Q31.2(B) R61.2
N$112: R61.1 U$24.1(Q1)
N$113: R62.1 U$24.15(Q0)
N$114: Q33.1(C) U$4.COM U$15.COM U$27.COM U$38.COM U$48.COM U$58.COM U$68.COM U$78.COM U$88.COM U$98.COM
N$115: R63.1 U$35.7(Q7)
N$116: R64.1 U$35.6(Q6)
N$117: R65.1 U$35.5(Q5)
N$118: R66.1 U$35.4(Q4)
N$119: R67.1 U$35.3(Q3)
N$120: R68.1 U$35.2(Q2)
N$121: R69.1 U$35.1(Q1)
N$122: R70.1 U$35.15(Q0)
N$123: R59.1 U$24.2(Q2)
N$124: R57.1 U$24.3(Q3)
N$125: R55.1 U$24.4(Q4)
N$126: R53.1 U$24.5(Q5)
N$127: R51.1 U$24.6(Q6)
N$128: R49.1 U$24.7(Q7)
N$129: R47.1 U$23.15(Q0)
N$130: R45.1 U$23.1(Q1)
N$131: R43.1 U$23.2(Q2)
N$132: R41.1 U$23.3(Q3)
N$133: R39.1 U$23.4(Q4)
N$134: R37.1 U$23.5(Q5)
N$135: R35.1 U$23.6(Q6)
N$136: R33.1 U$23.7(Q7)
N$137: R31.1 U$12.15(Q0)
N$138: R29.1 U$12.1(Q1)
N$139: R27.1 U$12.2(Q2)
N$140: R25.1 U$12.3(Q3)
N$141: R23.1 U$12.4(Q4)
N$142: R21.1 U$12.5(Q5)
N$143: R19.1 U$12.6(Q6)
N$144: R17.1 U$12.7(Q7)
N$145: R15.1 U$1.15(Q0)
N$146: R13.1 U$1.1(Q1)
N$147: R11.1 U$1.2(Q2)
N$148: R9.1 U$1.3(Q3)
N$149: R7.1 U$1.4(Q4)
N$150: R5.1 U$1.5(Q5)
N$151: R3.1 U$1.6(Q6)
N$152: R1.1 U$1.7(Q7)
N$153: JP1.2 X1.26
N$154: R74.2 U$1.11(SHCP) U$12.11(SHCP) U$23.11(SHCP) U$24.11(SHCP) U$35.11(SHCP) X1.21
N$155: U$1.9(Q7S) U$12.14(DS)
N$156: U$12.9(Q7S) U$23.14(DS)
N$157: U$23.9(Q7S) U$24.14(DS)
N$158: U$24.9(Q7S) U$35.14(DS)
N$159: JP1.4 X1.24
N$160: IC1.3(B1) R76.1
N$161: IC1.4(B2) R77.1
N$162: JP1.6 X1.22
N$163: IC1.5(CLR) R78.2
N$164: JP1.8 X1.18
N$165: JP1.16 X1.8
N$166: JP1.14 X1.10
N$167: JP1.12 X1.12
N$168: JP1.1 JP1.3 JP1.5 JP1.7 JP1.9 JP1.11 JP1.13 JP1.15 JP1.17 U$1.14(DS)
N$169: JP1.18 X1.15
N$170: C_1.1 IC1.9(R)
N$172: IC1.1(A1) R71.2 U$1.12(STCP) U$12.12(STCP) U$23.12(STCP) U$24.12(STCP) U$35.12(STCP) X1.23
N$173: C_T.1 IC1.13(R/C) R_T.1
N$175: IC1.8(Q) R_V1.2
N$176: R_V1.1 T1.2(B)
N$178: IC2.2(IN) R_V2.2 T1.1(C)
N$180: C1.2 C3.2 IC1.14(VCC) IC2.3(VBB) POWER1.1 R75.2 R76.2 R77.2 R78.1 R_T.2 R_V2.1
VCC: IC2.1(O1) IC2.5(O2) Q1.1(C) Q2.1(C) Q3.1(C) Q4.1(C) Q5.1(C) Q6.1(C) Q7.1(C) Q8.1(C) Q9.1(C) Q10.1(C) Q11.1(C) Q12.1(C) Q13.1(C) Q14.1(C) Q15.1(C) Q16.1(C) Q17.1(C) Q18.1(C) Q19.1(C) Q20.1(C) Q21.1(C) Q22.1(C) Q23.1(C) Q24.1(C) Q25.1(C) Q26.1(C) Q27.1(C) Q28.1(C) Q29.1(C) Q30.1(C) U$1.10(MR) U$1.16(VCC) U$12.10(MR) U$12.16(VCC) U$23.10(MR) U$23.16(VCC) U$24.10(MR) U$24.16(VCC) U$35.10(MR) U$35.16(VCC)
Unconnected: IC1.6(!Q) IC2.4(IS) U$35.9(Q7S) X1.1 X1.2 X1.3 X1.4 X1.5 X1.7 X1.11 X1.13 X1.17 X1.19

## Notes on the sheet
- GPIO 22
- GPIO 14
- GPIO 15
- GPIO 18
- GPIO 23
- GPIO 24
- GPIO 25
- GPIO 08
- GPIO 07
- Clock Storage Signal
- Supply Voltage

## Library data of the parts
C1 C3 C_1 C_T = capacitor-wima:C: CAPACITOR naming: grid - package width
IC1 = 74xx-eu:74*122: Retriggerable monostable MULTIVIBRATOR
IC2 = infineon:BTS555: PROFET® Data Sheet BTS555 Source: http://www.infineon.com/upload/Document/cmc_upload/documents/011/8726/Datasheet_BTS555.pdf
JP1 = jumper:JP9Q: JUMPER
POWER1 = con-wago-500:W237-102: WAGO SCREW CLAMP
Q1-Q40 T1 = transistor:2N3565: NPN TRANSISTOR
R1-R71 R74-R77 R_T R_V1 R_V2 = resistor:R-EU_: RESISTOR, European symbol
R78 = rcl:R-EU_: RESISTOR, European symbol
U$1 U$12 U$23 U$24 U$35 = RGB_LED:74_595_SHIFT_REGISTER
U$2-U$11 U$13-U$22 U$25-U$34 U$36-U$105 = RGB_LED:RGB_KINGBRIGHT_5MM
X1 = con-molex:87758-2616: 26 Pin - 2mm Dual Row Single Wafer, Vertical T/H HDR Source: http://www.molex.com/pdm_docs/sd/877580616_sd.pdf